# Altium schematic sheet 05-DETECT-ps2-blueretro.SchDoc
size A; SheetNumber: 6; SheetTotal: 6
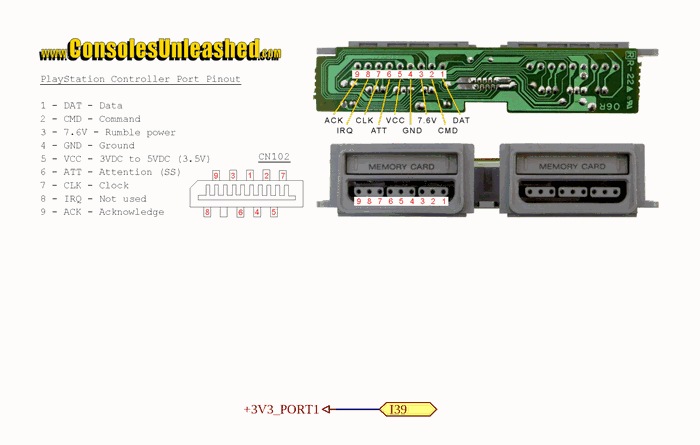
[diagram p0: 05-DETECT-ps2-blueretro.SchDoc]

## Ports
I39 (bidir, see 00-ps2-blueretro[3C], 01-ESP32-ps2-blueretro[2B])

## Nets
+3V3_PORT1: port I39